# Altium project PMI_carte_principale.PrjPCB
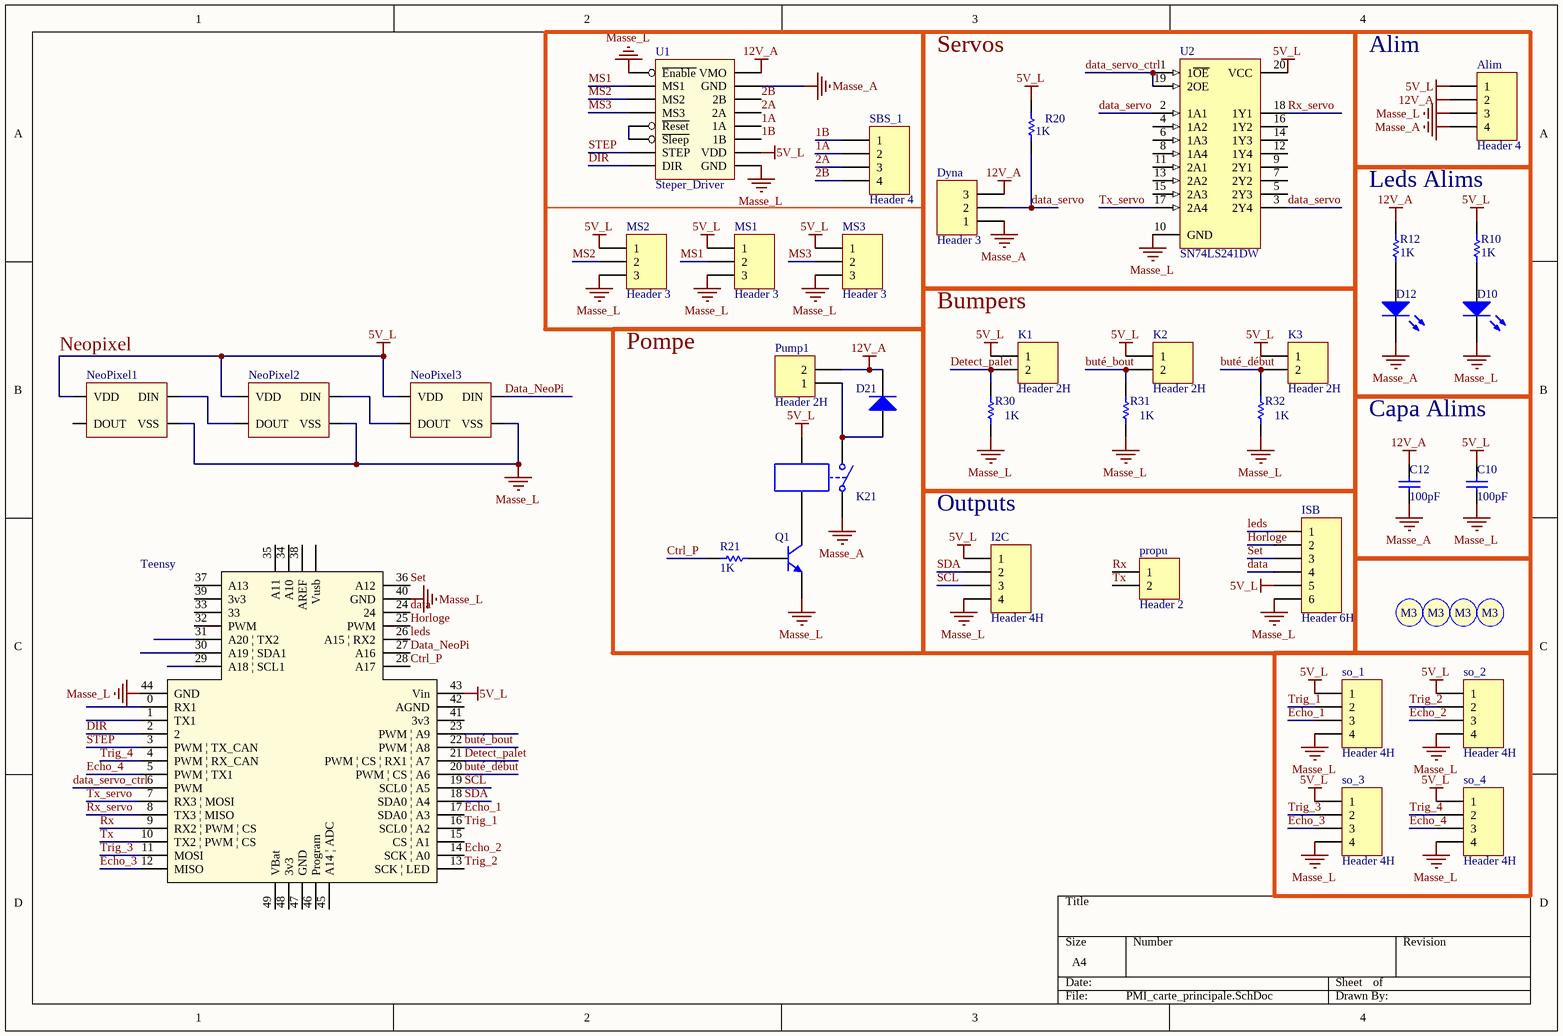
[diagram p0: PMI_carte_principale.SchDoc]
1 sheet, 41 parts. Net scope: global (net labels, ports and power ports of the same name join across sheets).
Board file: PMI_carte_principale.PcbDoc

## Sheet PMI_carte_principale.SchDoc
size A4

### Parts
Alim  Header 4  [Molex_MiniFitJr_2x2]
C10  value 100pF  [Condensateur]  (hidden comment: Cap)
C12  value 100pF  [Condensateur]  (hidden comment: Cap)
D10  LED0  [3.2X1.6X1.1]  (value not drawn)
D12  LED0  [3.2X1.6X1.1]  (value not drawn)
D21  Diode  [3.2X1.6X1.1]  (value not drawn)
Dyna  Header 3  [MOLEX SPOX 3x1 M]
I2C  Header 4H  [MOLEX SPOX 4x1 M]
ISB  Header 6H  [MOLEX SPOX 6x1 M]
K1  Header 2H  [MOLEX SPOX 2x1 M]
K2  Header 2H  [MOLEX SPOX 2x1 M]
K3  Header 2H  [MOLEX SPOX 2x1 M]
K21  Relay-SPST  [Relay]  (value not drawn)
MS1  Header 3  [HDR1X3]
MS2  Header 3  [HDR1X3]
MS3  Header 3  [HDR1X3]
NeoPixel1  NeoPixel1  [Neopixel]  (value not drawn)
NeoPixel2  NeoPixel2  [Neopixel]  (value not drawn)
NeoPixel3  NeoPixel3  [Neopixel]  (value not drawn)
propu  Header 2  [MOLEX SPOX 2x1 M]
Pump1  Header 2H  [MOLEX SPOX 2x1 M]
Q1  NPN  [TO-226-AA]  (value not drawn)
R10  value 1K  [3.2X1.6X1.1]  (hidden comment: Res_5V_A)
R12  value 1K  [3.2X1.6X1.1]  (hidden comment: Res_5V_A)
R20  value 1K  [3.2X1.6X1.1]  (hidden comment: Res_5V_A)
R21  value 1K  [3.2X1.6X1.1]  (hidden comment: ResP)
R30  value 1K  [3.2X1.6X1.1]  (hidden comment: Res1)
R31  value 1K  [3.2X1.6X1.1]  (hidden comment: Res1)
R32  value 1K  [3.2X1.6X1.1]  (hidden comment: Res1)
SBS_1  Header 4  [MOLEX SPOX 4x1 M]
Screw_1  Screw M3  [Screw M3]  (value not drawn)
Screw_2  Screw M3  [Screw M3]  (value not drawn)
Screw_3  Screw M3  [Screw M3]  (value not drawn)
Screw_4  Screw M3  [Screw M3]  (value not drawn)
so_1  Header 4H  [MOLEX SPOX 4x1 M]
so_2  Header 4H  [MOLEX SPOX 4x1 M]
so_3  Header 4H  [MOLEX SPOX 4x1 M]
so_4  Header 4H  [MOLEX SPOX 4x1 M]
Teensy  Teensy 3.2  [teensy]  (value not drawn)
U1  Steper_Driver  [DRV8825]
U2  SN74LS241DW  [DW020_N]

### Nets
5V_L: Alim.1 C10.1 I2C.1 ISB.5 K1.1 K2.1 K3.1 K21.4 MS1.1 MS2.1 MS3.1 NeoPixel1.4(VDD) NeoPixel2.4(VDD) NeoPixel3.4(VDD) R10.2 R20.1 so_1.1 so_2.1 so_3.1 so_4.1 Teensy.43(Vin) U1.10(VDD) U2.20(VCC)
12V_A: Alim.2 C12.1 D21.2(K) Dyna.3 Pump1.2 R12.2 U1.16(VMO)
Masse_A: Alim.4 C12.2 D12.2(K) Dyna.1 K21.1 U1.15(GND)
Masse_L: Alim.3 C10.2 D10.2(K) I2C.4 ISB.6 MS1.3 MS2.3 MS3.3 NeoPixel1.2(VSS) NeoPixel2.2(VSS) NeoPixel3.2(VSS) Q1.3(E) R30.1 R31.1 R32.1 so_1.4 so_2.4 so_3.4 so_4.4 Teensy.40(GND) Teensy.44(GND) U1.1(~{Enable}) U1.9(GND) U2.10(GND)
1A: SBS_1.2 U1.12(1A)
1B: SBS_1.1 U1.11(1B)
2A: SBS_1.3 U1.13(2A)
2B: SBS_1.4 U1.14(2B)
buté_bout: K2.2 R31.2 Teensy.22(PWM_|_A8)
buté_début: K3.2 R32.2 Teensy.20(PWM_|_CS_|_A6)
Ctrl_P: R21.1 Teensy.28(A17)
data: ISB.4 Teensy.24
Data_NeoPi: NeoPixel3.3(DIN) Teensy.27(A16)
data_servo: Dyna.2 R20.2 U2.2(1A1) U2.3(2Y4)
data_servo_ctrl: Teensy.6(PWM) U2.1(1~{OE}) U2.19(2OE)
Detect_palet: K1.2 R30.2 Teensy.21(PWM_|_CS_|_RX1_|_A7)
DIR: Teensy.2 U1.8(DIR)
Echo_1: so_1.3 Teensy.17(SDA0_|_A3)
Echo_2: so_2.3 Teensy.14(SCK_|_A0)
Echo_3: so_3.3 Teensy.12(MISO)
Echo_4: so_4.3 Teensy.5(PWM_|_TX1)
Horloge: ISB.2 Teensy.25(PWM)
leds: ISB.1 Teensy.26(A15_|_RX2)
MS1: MS1.2 U1.2(MS1)
MS2: MS2.2 U1.3(MS2)
MS3: MS3.2 U1.4(MS3)
Rx: propu.1 Teensy.9(RX2_|_PWM_|_CS)
Rx_servo: Teensy.8(TX3_|_MISO) U2.18(1Y1)
SCL: I2C.3 Teensy.19(SCL0_|_A5)
SDA: I2C.2 Teensy.18(SDA0_|_A4)
Set: ISB.3 Teensy.36(A12)
STEP: Teensy.3(PWM_|_TX_CAN) U1.7(STEP)
Trig_1: so_1.2 Teensy.16(SCL0_|_A2)
Trig_2: so_2.2 Teensy.13(SCK_|_LED)
Trig_3: so_3.2 Teensy.11(MOSI)
Trig_4: so_4.2 Teensy.4(PWM_|_RX_CAN)
Tx: propu.2 Teensy.10(TX2_|_PWM_|_CS)
Tx_servo: Teensy.7(RX3_|_MOSI) U2.17(2A4)
NetD10_1: D10.1(A) R10.1
NetD12_1: D12.1(A) R12.1
NetD21_1: D21.1(A) K21.2 Pump1.1
NetK21_3: K21.3 Q1.1(C)
NetNeoPixel1_3: NeoPixel1.3(DIN) NeoPixel2.1(DOUT)
NetNeoPixel2_3: NeoPixel2.3(DIN) NeoPixel3.1(DOUT)
NetQ1_2: Q1.2(B) R21.2
NetU1_5: U1.5(~{Reset}) U1.6(~{Sleep})

Not connected (* = marked no-connect by the designer): NeoPixel1 1(DOUT); Teensy 0(RX1) 1(TX1) 15(CS_|_A1) 23(PWM_|_A9) 29(A18_|_SCL1) 30(A19_|_SDA1) 31(A20_|_TX2) 32(PWM) 33 34(A10) 35(A11) 37(A13) 38(AREF) 39(3v3) 41(3v3) 42(AGND) 45(A14_|_ADC) 46(Program) 47(GND) 48(3v3) 49(VBat) 50(Vusb); U2 4(1A2) 5(2Y3) 6(1A3) 7(2Y2) 8(1A4) 9(2Y1) 11(2A1) 12(1Y4) 13(2A2) 14(1Y3) 15(2A3) 16(1Y2)

### Notes on the sheet
- (near NeoPixel1) Neopixel
- Labels drawn without touching a wire or pin: Alim, Bumpers, Capa Alims, Leds Alims, Outputs, Pompe, Servos
- (in symbol Screw M3) M3

### Library data of the parts
Alim SBS_1 = Header 4: Header, 4-Pin; LatestRevisionDate: 17-Jul-2002; LatestRevisionNote: Re-released for DXP Platform.; Publisher: Altium Limited
C10 C12 = Cap: Capacitor; Published: 8-Jun-2000; LatestRevisionDate: 17-Jul-2002; LatestRevisionNote: Re-released for DXP Platform.; PackageReference: RAD-0.3; Publisher: Altium Limited; PackageDescription: Radial Cap, Thru-Hole; 2 Leads; 0.3 in Pin Spacing
D10 D12 = LED0: Typical INFRARED GaAs LED; Published: 8-Jun-2000; LatestRevisionDate: 08-Jul-2005; LatestRevisionNote: Mech Layer 1 removed.; PackageReference: LED-0; Publisher: Altium Limited; PackageDescription: LED; 2 Leads
D21 = Diode: Default Diode; Published: 8-Jun-2000; LatestRevisionDate: 17-Jul-2002; LatestRevisionNote: Re-released for DXP Platform.; PackageVersion: Sep-1996; PackageReference: SMC; Publisher: Altium Limited; PackageDescription: DO-214-AB/SMC; 2 C-Bend Leads; Body 7.9 x 5.9 mm, inc. leads (LxW); Code_JEDEC: DO-214-AB
Dyna MS1-MS3 = Header 3: Header, 3-Pin; LatestRevisionDate: 17-Jul-2002; LatestRevisionNote: Re-released for DXP Platform.; Publisher: Altium Limited
I2C so_1-so_4 = Header 4H: Header, 4-Pin, Right Angle; LatestRevisionDate: 17-Jul-2002; LatestRevisionNote: Re-released for DXP Platform.; Publisher: Altium Limited
ISB = Header 6H: Header, 6-Pin, Right Angle; LatestRevisionDate: 17-Jul-2002; LatestRevisionNote: Re-released for DXP Platform.; Publisher: Altium Limited
K1-K3 Pump1 = Header 2H: Header, 2-Pin, Right Angle; LatestRevisionDate: 17-Jul-2002; LatestRevisionNote: Re-released for DXP Platform.; Publisher: Altium Limited
K21 = Relay-SPST: Single-Pole Single-Throw Relay; Published: 24-Mar-1999; LatestRevisionDate: 17-Jul-2002; LatestRevisionNote: Re-released for DXP Platform.; PackageReference: MODULE4; Publisher: Altium Limited
NeoPixel1-NeoPixel3 = NeoPixel
propu = Header 2: Header, 2-Pin; LatestRevisionDate: 17-Jul-2002; LatestRevisionNote: Re-released for DXP Platform.; Publisher: Altium Limited
Q1 = NPN: NPN Bipolar Transistor; Published: 8-Jun-2000; LatestRevisionDate: 17-Jul-2002; LatestRevisionNote: Re-released for DXP Platform.; PackageReference: TO-226-AA; Publisher: Altium Limited; PackageDescription: TO, Flat Index; 3 In-Line, Axial Leads; Body Dia. 4.8mm; Leads 0.55 x 0.51 mm (max); Code_JEDEC: TO-226-AA
R10 R12 R20 R21 R30-R32 = Res1: Resistor; Published: 8-Jun-2000; LatestRevisionDate: 17-Jul-2002; LatestRevisionNote: Re-released for DXP Platform.; PackageReference: AXIAL-0.3; Publisher: Altium Limited; PackageDescription: Axial Device, Thru-Hole; 2 Leads; 0.3 in Pin Spacing
Teensy = teensy3.2
U1 = Steper_Driver: A4988
U2 = SN74LS241DW: Octal Buffer and Line Driver with 3-State Outputs; ComponentAvailability: Obsolete; Published: 8-Jun-2000; LatestRevisionDate: 13-Apr-2006; LatestRevisionNote: IPC-7351 Footprint Added.; DatasheetVersion: Mar-1988; PackageVersion: Mar-2000; PackageReference: DW020; Publisher: Altium Limited; PackageDescription: 20-Pin Plastic Small Outline Integrated Circuit 1.27 mm Pitch; Code_JEDEC: MS-013; Code_IPC: SOIC127P1030-20; ComponentLink1Description: Manufacturer Link; ComponentLink1URL: http://www.ti.com/; ComponentLink2Description: Datasheet; ComponentLink2URL: http://www-s.ti.com/sc/ds/sn74ls240.pdf